# EAGLE design USBBoard (EAGLE 6.5.0)
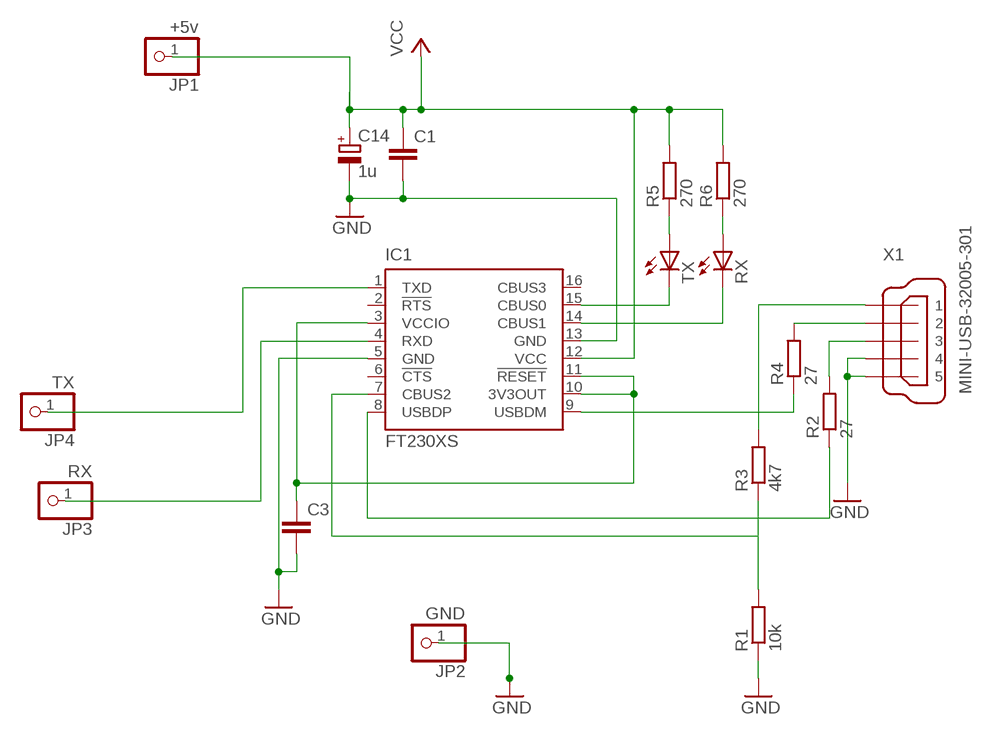
[diagram p0: schematic, sheet 1]

## Parts
C1  C-EU050-025X075  [C050-025X075]
C3  C-EU050-025X075  [C050-025X075]
C14  1u  CPOL-EUE2-4  [E2-4]
IC1  FT230XS  [SSOP16]
JP1  +5v  PINHD-1X1  [1X01]
JP2  GND  PINHD-1X1  [1X01]
JP3  RX  PINHD-1X1  [1X01]
JP4  TX  PINHD-1X1  [1X01]
R1  10k  R-EU_0207/2V  [0207/2V]
R2  27  R-EU_0207/2V  [0207/2V]
R3  4k7  R-EU_0207/2V  [0207/2V]
R4  27  R-EU_0207/2V  [0207/2V]
R5  270  R-EU_0207/2V  [0207/2V]
R6  270  R-EU_0207/2V  [0207/2V]
RX  LED3MM  [LED3MM]
TX  LED3MM  [LED3MM]
X1  MINI-USB-32005-301  [32005-301]

## Nets
GND: C1.2 C3.2 C14.- IC1.13(GND) JP2.1 R1.1 X1.4 X1.5
N$1: IC1.1(TXD) JP4.1
N$2: IC1.4(RXD) JP3.1
N$3: C3.1 IC1.3(VCCIO) IC1.10(3V3OUT) IC1.11(!RESET)
N$4: R3.2 X1.1
N$5: R2.2 X1.3
N$6: R4.2 X1.2
N$7: IC1.7(CBUS2) R1.2 R3.1
N$8: IC1.9(USBDM) R4.1
N$9: IC1.8(USBDP) R2.1
N$10: IC1.14(CBUS1) RX.K(C)
N$11: IC1.15(CBUS0) TX.K(C)
N$12: R5.1 TX.A
N$13: R6.1 RX.A
VCC: C1.1 C14.+ IC1.12(VCC) JP1.1 R5.2 R6.2
Unconnected: IC1.2(!RTS) IC1.6(!CTS) IC1.16(CBUS3)

## Power pins joined to a net without a drawn wire
GND: IC1.5(GND)

## Library data of the parts
C1 C3 = rcl:C-EU: CAPACITOR, European symbol
C14 = rcl:CPOL-EU: POLARIZED CAPACITOR, European symbol
IC1 = ftdichip:FT230X: USB to BASIC UART IC Auto generated by make-symbol-device-package-bsdl.ulp Rev. 43 Source: Data sheet <http://www.ftdichip.com/Support/Documents/DataSheets/ICs/DS_FT230X.pdf>
JP1-JP4 = pinhead:PINHD-1X1: PIN HEADER
R1-R6 = rcl:R-EU_: RESISTOR, European symbol
RX TX = led:LED: LED OSRAM: - CHIPLED LG R971, LG N971, LY N971, LG Q971, LY Q971, LO R971, LY R971 LH N974, LH R974 LS Q976, LO Q976, LY Q976 LO Q996 - Hyper CHIPLED LW Q18S LB Q993, LB Q99A, LB R99A - SideLED LS A670, LO A670, LY A670, LG A670, LP A670 LB A673, LV A673, LT A673, LW A673 LH A674 LY A675 LS A676, LA A676, LO A676, LY A676, LW A676 LS A679, LY A679, LG A679 - Hyper Micro SIDELED® LS Y876, LA Y876, LO Y876, LY Y876 LT Y87S - SmartLED LW L88C, LW L88S LB L89C, LB L89S, LG L890 LS L89K, LO L89K, LY L89K LS L896, LA L896, LO L896, LY L896 - TOPLED LS T670, LO T670, LY T670, LG T670, LP T670 LSG T670, LSP T670, LSY T670, LOP T670, LYG T670 LG T671, LOG T671, LSG T671 LB T673, LV T673, LT T673, LW T673 LH T674 LS T676, LA T676, LO T676, LY T676, LB T676, LH T676, LSB T676, LW T676 LB T67C, LV T67C, LT T67C, LS T67K, LO T67K, LY T67K, LW E67C LS E67B, LA E67B, LO E67B, LY E67B, LB E67C, LV E67C, LT E67C LW T67C LS T679, LY T679, LG T679 LS T770, LO T770, LY T770, LG T770, LP T770 LB T773, LV T773, LT T773, LW T773 LH T774 LS E675, LA E675, LY E675, LS T675 LS T776, LA T776, LO T776, LY T776, LB T776 LHGB T686 LT T68C, LB T68C - Hyper Mini TOPLED® LB M676 - Mini TOPLED Santana® LG M470 LS M47K, LO M47K, LY M47K Source: http://www.osram.convergy.de LUXEON: - LUMILED® LXK2-PW12-R00, LXK2-PW12-S00, LXK2-PW14-U00, LXK2-PW14-V00 LXK2-PM12-R00, LXK2-PM12-S00, LXK2-PM14-U00 LXK2-PE12-Q00, LXK2-PE12-R00, LXK2-PE12-S00, LXK2-PE14-T00, LXK2-PE14-U00 LXK2-PB12-K00, LXK2-PB12-L00, LXK2-PB12-M00, LXK2-PB14-N00, LXK2-PB14-P00, LXK2-PB14-Q00 LXK2-PR12-L00, LXK2-PR12-M00, LXK2-PR14-Q00, LXK2-PR14-R00 LXK2-PD12-Q00, LXK2-PD12-R00, LXK2-PD12-S00 LXK2-PH12-R00, LXK2-PH12-S00 LXK2-PL12-P00, LXK2-PL12-Q00, LXK2-PL12-R00 Source: www.luxeon.com KINGBRIGHT: KA-3528ASYC Source: www.kingbright.com
X1 = con-cypressindustries:MINI-USB-: MINI USB-B Conector Source: www.cypressindustries.com; OC_FARNELL: unknown; OC_NEWARK: unknown

## Board
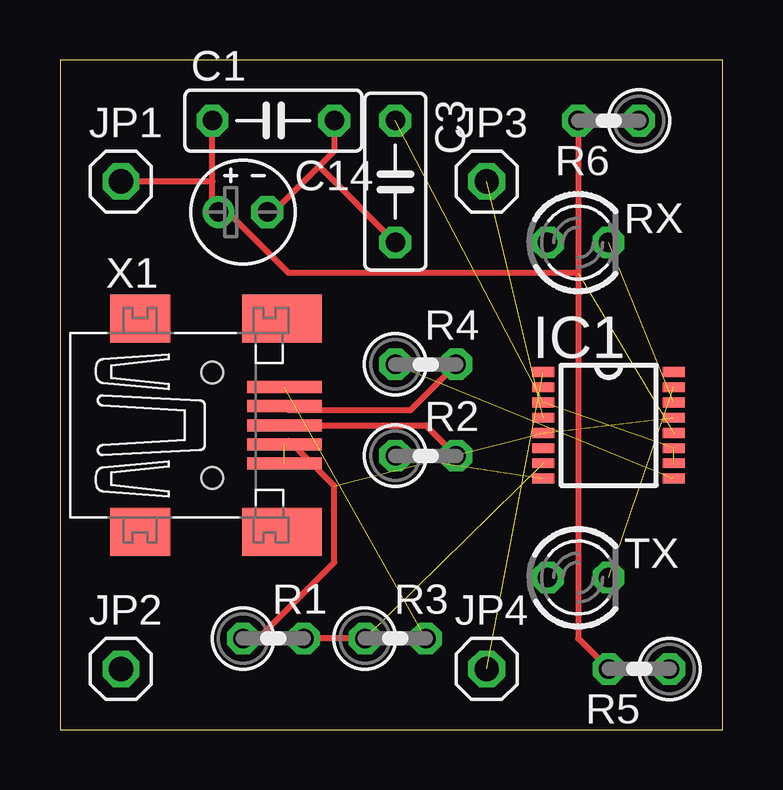
[diagram p1: board, top side]
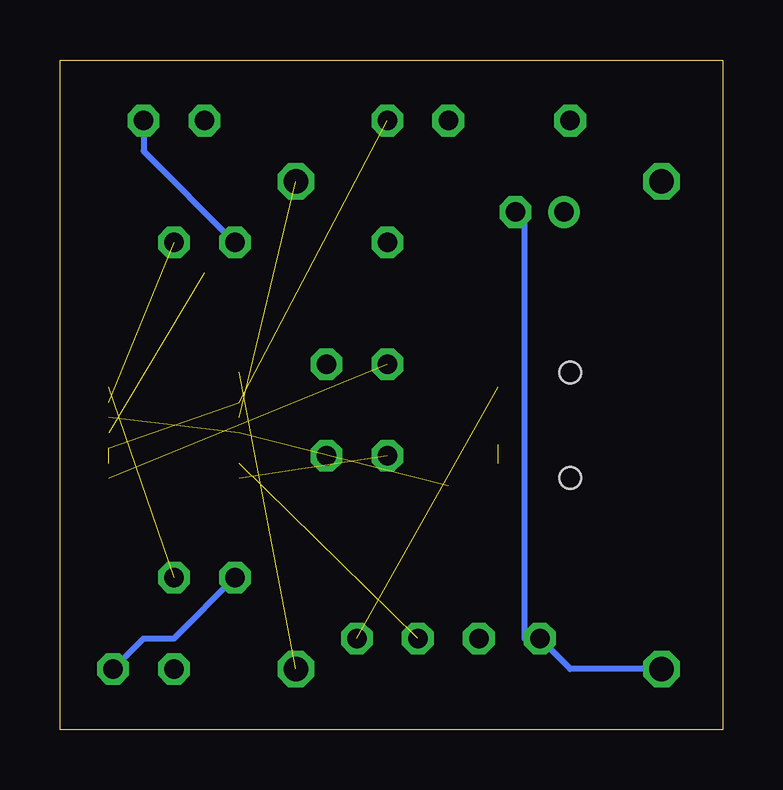
[diagram p2: board, bottom side, seen from below]

Size 27.61 x 27.93 mm. Coordinates in mm from the lower left corner, seen from the top.
Outline: 0,0 27.61,0 27.61,27.93 0,27.93 0,0
Copper layers (1*16): Top 0.035mm / dielectric 1.5mm / Bottom 0.035mm
Design rules "10mils": minimum track width 10mil, minimum drill 24mil, track to track 10mil, track to pad 10mil, pad to pad 10mil, via to via 10mil, smd to smd 10mil, copper to edge 40mil, drill to drill 10mil, minimum pad ring 10mil, minimum via ring 8mil, stop-mask expansion 0mil, vias tented up to drill 0mil, thermal gap 10mil

### Footprints (pad centres in the part's own frame; a part is rotated, then mirrored left to right if it is on the bottom)
C050-025X075 = drill 0.813 octagon: 1 -2.54,0; 2 2.54,0
E2-4 = drill 0.813 pad 1.27: + -1.016,0 | drill 0.813 pad 1.27 octagon: - 1.016,0
SSOP16 = smd 0.914 x 0.406: 1 -2.718,2.223; 2 -2.718,1.587; 3 -2.718,0.953; 4 -2.718,0.318; 5 -2.718,-0.318; 6 -2.718,-0.953; 7 -2.718,-1.587; 8 -2.718,-2.223; 9 2.718,-2.223; 10 2.718,-1.587; 11 2.718,-0.953; 12 2.718,-0.318; 13 2.718,0.318; 14 2.718,0.953; 15 2.718,1.587; 16 2.718,2.223
1X01 = drill 1.016 octagon: 1 0,0
0207/2V = drill 0.813 octagon: 1 -1.27,0; 2 1.27,0
LED3MM = drill 0.813 octagon: A -1.27,0; K 1.27,0
32005-301 = smd 3.1 x 0.5: 1 3,1.6; 2 3,0.8; 3 3,0; 4 3,-0.8; 5 3,-1.6 | smd 2.5 x 2: M1 -3,-4.45; M2 -3,4.45 | smd 3.3 x 2: M3 2.9,4.45; M4 2.9,-4.45 | hole 0.9: 0,2.2; 0,-2.2

### Placement (x,y rotation side)
C1  8.89,25.4 0 top
C3  13.97,22.86 270 top
C14  7.62,21.59 0 top
IC1  22.86,12.7 0 top
JP1  2.54,22.86 0 top
JP2  2.54,2.54 0 top
JP3  17.78,22.86 0 top
JP4  17.78,2.54 0 top
R1  8.89,3.81 0 top
R2  15.24,11.43 0 top
R3  13.97,3.81 0 top
R4  15.24,15.24 0 top
R5  24.13,2.54 180 top
R6  22.86,25.4 180 top
RX  21.59,20.32 0 top
TX  21.59,6.35 0 top
X1  6.35,12.7 0 top

### Tracks (layer width: path | path; a pad name or v marks a point on that pad's centre or on a via)
GND  (3 unrouted)
  Top 0.254: 10.79,23.5 11.43,24.13 C1.2 | 10.79,23.5 8.89,21.59 C14.- | 10.79,23.5 C3.2 | R1.1 8.26,3.81 11.43,6.99 11.43,10.16 9.53,12.06 X1.4
  Bottom 0.254: JP2.1 6.35,2.54 R1.1 8.26,3.81 8.26,21.59 C14.-
N$1  (1 unrouted)
N$2  (1 unrouted)
N$3  (3 unrouted)
N$4  (1 unrouted)
N$5
  Top 0.254: R2.2 15.24,12.7 X1.3
N$6
  Top 0.254: R4.2 14.61,13.34 9.53,13.34 X1.2
N$7  (1 unrouted)
  Top 0.254: R3.1 R1.2
N$8  (1 unrouted)
N$9  (1 unrouted)
N$10  (1 unrouted)
N$11  (1 unrouted)
N$12
  Bottom 0.254: TX.A 22.86,3.81 24.13,3.81 R5.1
N$13
  Bottom 0.254: RX.A 24.13,24.13 R6.1
VCC  (1 unrouted)
  Top 0.254: 6.35,22.86 6.35,21.59 C14.+ 6.99,21.59 9.53,19.05 21.59,19.05 | 6.35,22.86 C1.1 | 6.35,22.86 JP1.1 | R5.2 21.59,3.81 21.59,19.05 | R6.2 21.59,19.05